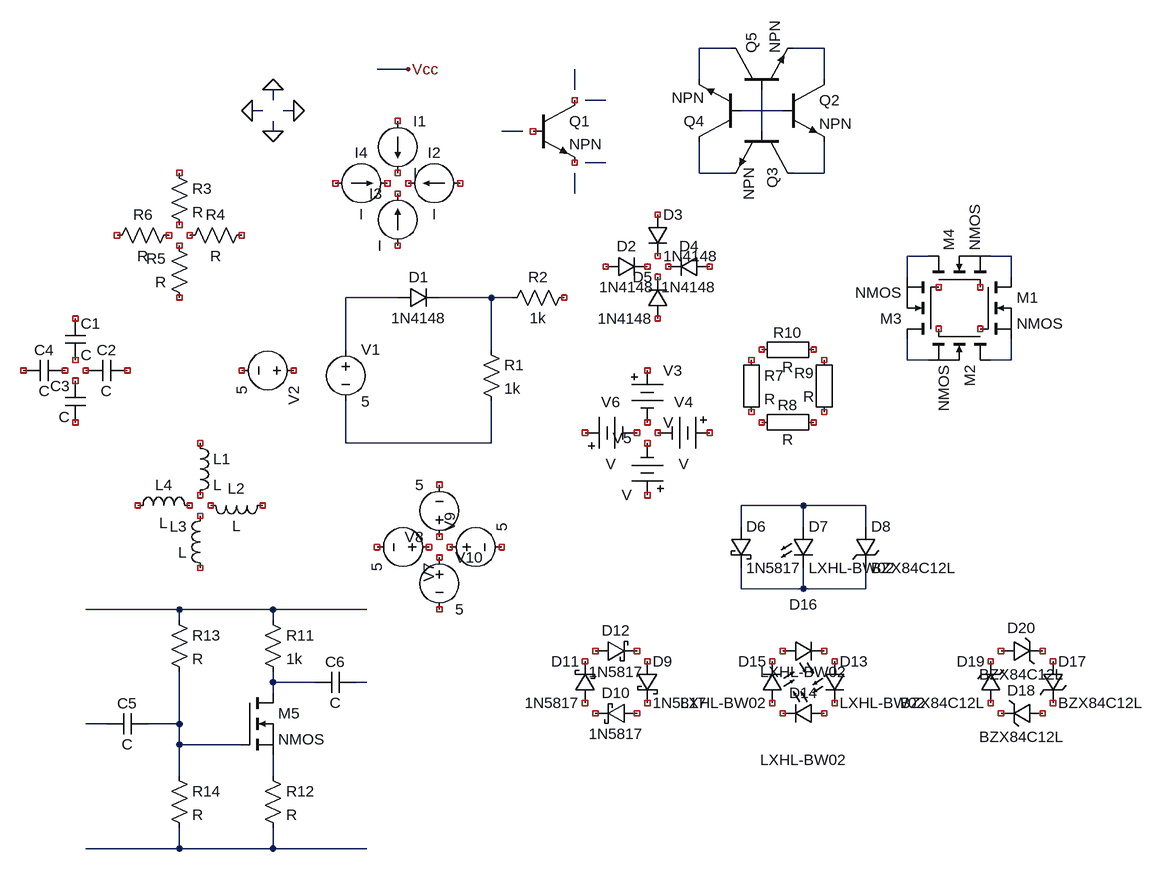
[diagram p0: schematic 20220804_circuit_01.asc]
20220804_circuit_01.asc, the LTspice schematic file:
Version 4
SHEET 1 1360 920
WIRE 720 -320 672 -320
WIRE 864 -320 816 -320
WIRE 224 -288 176 -288
WIRE 672 -272 672 -320
WIRE 864 -272 864 -320
WIRE 480 -256 480 -288
WIRE 16 -240 16 -256
WIRE 528 -240 496 -240
WIRE 0 -224 -16 -224
WIRE 48 -224 32 -224
WIRE 800 -224 736 -224
WIRE 16 -192 16 -208
WIRE 400 -192 368 -192
WIRE 768 -192 768 -256
WIRE 528 -144 496 -144
WIRE 672 -128 672 -176
WIRE 720 -128 672 -128
WIRE 864 -128 864 -176
WIRE 864 -128 816 -128
WIRE 480 -96 480 -128
WIRE 1024 0 992 0
WIRE 1152 0 1120 0
WIRE 992 32 992 0
WIRE 1152 32 1152 0
WIRE 208 64 128 64
WIRE 352 64 272 64
WIRE 384 64 352 64
WIRE 128 144 128 64
WIRE 352 144 352 64
WIRE 992 160 992 128
WIRE 1024 160 992 160
WIRE 1152 160 1152 128
WIRE 1152 160 1120 160
WIRE 128 288 128 224
WIRE 352 288 352 224
WIRE 352 288 128 288
WIRE 832 384 736 384
WIRE 928 384 832 384
WIRE 736 416 736 384
WIRE 832 416 832 384
WIRE 928 416 928 384
WIRE 736 512 736 480
WIRE 832 512 832 480
WIRE 832 512 736 512
WIRE 928 512 928 480
WIRE 928 512 832 512
WIRE -128 544 -272 544
WIRE 16 544 -128 544
WIRE 160 544 16 544
WIRE -128 560 -128 544
WIRE 16 560 16 544
WIRE 16 656 16 640
WIRE 80 656 16 656
WIRE 160 656 144 656
WIRE 16 672 16 656
WIRE -240 720 -272 720
WIRE -128 720 -128 640
WIRE -128 720 -176 720
WIRE -128 752 -128 720
WIRE -32 752 -128 752
WIRE -128 800 -128 752
WIRE 16 800 16 768
WIRE -128 912 -128 880
WIRE -128 912 -272 912
WIRE 16 912 16 880
WIRE 16 912 -128 912
WIRE 160 912 16 912
FLAG 16 -192 0
FLAG 48 -224 0
FLAG -16 -224 0
FLAG 16 -256 0
FLAG 224 -288 Vcc
SYMBOL voltage 128 128 R0
WINDOW 123 0 0 Left 0
WINDOW 39 0 0 Left 0
SYMATTR InstName V1
SYMATTR Value 5
SYMBOL res 336 128 R0
SYMATTR InstName R1
SYMATTR Value 1k
SYMBOL diode 208 80 R270
WINDOW 0 32 32 VTop 2
WINDOW 3 0 32 VBottom 2
SYMATTR InstName D1
SYMATTR Value 1N4148
SYMBOL voltage 64 176 R90
WINDOW 123 0 0 Left 0
WINDOW 39 0 0 Left 0
SYMATTR InstName V2
SYMATTR Value 5
SYMBOL res 480 48 R90
WINDOW 0 0 56 VBottom 2
WINDOW 3 32 56 VTop 2
SYMATTR InstName R2
SYMATTR Value 1k
SYMBOL res -144 -144 R0
SYMATTR InstName R3
SYMBOL res -16 -48 R90
WINDOW 0 0 56 VBottom 2
WINDOW 3 32 56 VTop 2
SYMATTR InstName R4
SYMBOL res -112 80 R180
WINDOW 0 36 76 Left 2
WINDOW 3 36 40 Left 2
SYMATTR InstName R5
SYMBOL res -240 -16 R270
WINDOW 0 32 56 VTop 2
WINDOW 3 0 56 VBottom 2
SYMATTR InstName R6
SYMBOL diode 528 32 R270
WINDOW 0 32 32 VTop 2
WINDOW 3 0 32 VBottom 2
SYMATTR InstName D2
SYMATTR Value 1N4148
SYMBOL diode 592 -64 R0
SYMATTR InstName D3
SYMATTR Value 1N4148
SYMBOL diode 688 0 R90
WINDOW 0 0 32 VBottom 2
WINDOW 3 32 32 VTop 2
SYMATTR InstName D4
SYMATTR Value 1N4148
SYMBOL diode 624 96 R180
WINDOW 0 24 64 Left 2
WINDOW 3 24 0 Left 2
SYMATTR InstName D5
SYMATTR Value 1N4148
SYMBOL Misc\\battery 592 160 R0
SYMATTR InstName V3
SYMBOL current 208 -208 R0
SYMATTR InstName I1
SYMBOL current 304 -112 R90
WINDOW 0 -32 40 VBottom 2
WINDOW 3 32 40 VTop 2
SYMATTR InstName I2
SYMBOL current 208 -16 R180
WINDOW 0 24 80 Left 2
WINDOW 3 24 0 Left 2
SYMATTR InstName I3
SYMBOL current 112 -112 R270
WINDOW 0 32 40 VTop 2
WINDOW 3 -32 40 VBottom 2
SYMATTR InstName I4
SYMBOL cap -304 96 R0
SYMATTR InstName C1
SYMBOL cap -208 160 R90
WINDOW 0 0 32 VBottom 2
WINDOW 3 32 32 VTop 2
SYMATTR InstName C2
SYMBOL cap -272 256 R180
WINDOW 0 24 56 Left 2
WINDOW 3 24 8 Left 2
SYMATTR InstName C3
SYMBOL cap -368 192 R270
WINDOW 0 32 32 VTop 2
WINDOW 3 0 32 VBottom 2
SYMATTR InstName C4
SYMBOL ind -112 272 R0
SYMATTR InstName L1
SYMBOL ind 16 368 R90
WINDOW 0 5 56 VBottom 2
WINDOW 3 32 56 VTop 2
SYMATTR InstName L2
SYMBOL ind -80 496 R180
WINDOW 0 36 80 Left 2
WINDOW 3 36 40 Left 2
SYMATTR InstName L3
SYMBOL ind -208 400 R270
WINDOW 0 32 56 VTop 2
WINDOW 3 5 56 VBottom 2
SYMATTR InstName L4
SYMBOL Misc\\battery 704 272 R90
WINDOW 0 -32 56 VBottom 2
WINDOW 3 32 56 VTop 2
SYMATTR InstName V4
SYMBOL Misc\\battery 592 384 R180
WINDOW 0 24 104 Left 2
WINDOW 3 24 16 Left 2
SYMATTR InstName V5
SYMBOL Misc\\battery 480 272 R270
WINDOW 0 32 56 VTop 2
WINDOW 3 -32 56 VBottom 2
SYMATTR InstName V6
SYMBOL voltage 272 448 R90
WINDOW 123 0 0 Left 0
WINDOW 39 0 0 Left 0
SYMATTR InstName V7
SYMATTR Value 5
SYMBOL voltage 272 448 R180
WINDOW 123 0 0 Left 0
WINDOW 39 0 0 Left 0
SYMATTR InstName V8
SYMATTR Value 5
SYMBOL voltage 272 448 R270
WINDOW 123 0 0 Left 0
WINDOW 39 0 0 Left 0
SYMATTR InstName V9
SYMATTR Value 5
SYMBOL voltage 272 448 R0
WINDOW 123 0 0 Left 0
WINDOW 39 0 0 Left 0
SYMATTR InstName V10
SYMATTR Value 5
SYMBOL npn 416 -240 R0
SYMATTR InstName Q1
SYMBOL npn 800 -272 R0
SYMATTR InstName Q2
SYMBOL npn 816 -192 R90
SYMATTR InstName Q3
SYMBOL npn 736 -176 R180
SYMATTR InstName Q4
SYMBOL npn 720 -256 R270
SYMATTR InstName Q5
SYMBOL Misc\\EuropeanResistor 736 144 R0
SYMATTR InstName R7
SYMBOL nmos 1104 32 R0
SYMATTR InstName M1
SYMBOL nmos 1120 112 R90
SYMATTR InstName M2
SYMBOL nmos 1040 128 R180
SYMATTR InstName M3
SYMBOL nmos 1024 48 R270
SYMATTR InstName M4
SYMBOL schottky 720 416 R0
SYMATTR InstName D6
SYMATTR Value 1N5817
SYMATTR Description Diode
SYMATTR Type diode
SYMBOL LED 816 416 R0
SYMATTR InstName D7
SYMATTR Value LXHL-BW02
SYMATTR Description Diode
SYMATTR Type diode
SYMBOL zener 912 416 R0
SYMATTR InstName D8
SYMATTR Value BZX84C12L
SYMATTR Description Diode
SYMATTR Type diode
SYMBOL schottky 576 624 R0
SYMATTR InstName D9
SYMATTR Value 1N5817
SYMATTR Description Diode
SYMATTR Type diode
SYMBOL schottky 576 688 R90
WINDOW 0 0 32 VBottom 2
WINDOW 3 32 32 VTop 2
SYMATTR InstName D10
SYMATTR Value 1N5817
SYMATTR Description Diode
SYMATTR Type diode
SYMBOL schottky 512 688 R180
WINDOW 0 24 64 Left 2
WINDOW 3 24 0 Left 2
SYMATTR InstName D11
SYMATTR Value 1N5817
SYMATTR Description Diode
SYMATTR Type diode
SYMBOL schottky 512 624 R270
WINDOW 0 32 32 VTop 2
WINDOW 3 0 32 VBottom 2
SYMATTR InstName D12
SYMATTR Value 1N5817
SYMATTR Description Diode
SYMATTR Type diode
SYMBOL LED 864 624 R0
SYMATTR InstName D13
SYMATTR Value LXHL-BW02
SYMATTR Description Diode
SYMATTR Type diode
SYMBOL LED 864 688 R90
WINDOW 0 0 32 VBottom 2
WINDOW 3 72 32 VTop 2
SYMATTR InstName D14
SYMATTR Value LXHL-BW02
SYMATTR Description Diode
SYMATTR Type diode
SYMBOL LED 800 688 R180
WINDOW 0 24 64 Left 2
WINDOW 3 24 0 Left 2
SYMATTR InstName D15
SYMATTR Value LXHL-BW02
SYMATTR Description Diode
SYMATTR Type diode
SYMBOL LED 800 624 R270
WINDOW 0 72 32 VTop 2
WINDOW 3 0 32 VBottom 2
SYMATTR InstName D16
SYMATTR Value LXHL-BW02
SYMATTR Description Diode
SYMATTR Type diode
SYMBOL zener 1200 624 R0
SYMATTR InstName D17
SYMATTR Value BZX84C12L
SYMATTR Description Diode
SYMATTR Type diode
SYMBOL zener 1200 688 R90
WINDOW 0 -4 32 VBottom 2
WINDOW 3 36 32 VTop 2
SYMATTR InstName D18
SYMATTR Value BZX84C12L
SYMATTR Description Diode
SYMATTR Type diode
SYMBOL zener 1136 688 R180
WINDOW 0 24 64 Left 2
WINDOW 3 24 0 Left 2
SYMATTR InstName D19
SYMATTR Value BZX84C12L
SYMATTR Description Diode
SYMATTR Type diode
SYMBOL zener 1136 624 R270
WINDOW 0 36 32 VTop 2
WINDOW 3 -4 32 VBottom 2
SYMATTR InstName D20
SYMATTR Value BZX84C12L
SYMATTR Description Diode
SYMATTR Type diode
SYMBOL Misc\\EuropeanResistor 864 240 R90
WINDOW 0 5 56 VBottom 2
WINDOW 3 27 56 VTop 2
SYMATTR InstName R8
SYMBOL Misc\\EuropeanResistor 880 256 R180
WINDOW 0 31 76 Left 2
WINDOW 3 31 40 Left 2
SYMATTR InstName R9
SYMBOL Misc\\EuropeanResistor 752 160 R270
WINDOW 0 27 56 VTop 2
WINDOW 3 5 56 VBottom 2
SYMATTR InstName R10
SYMBOL nmos -32 672 R0
SYMATTR InstName M5
SYMBOL res 0 544 R0
SYMATTR InstName R11
SYMATTR Value 1k
SYMBOL res 0 784 R0
SYMATTR InstName R12
SYMBOL res -144 544 R0
SYMATTR InstName R13
SYMBOL res -144 784 R0
SYMATTR InstName R14
SYMBOL cap -176 704 R90
WINDOW 0 0 32 VBottom 2
WINDOW 3 32 32 VTop 2
SYMATTR InstName C5
SYMBOL cap 144 640 R90
WINDOW 0 0 32 VBottom 2
WINDOW 3 32 32 VTop 2
SYMATTR InstName C6

The netlist it stands for:
* 20220804_circuit_01.asc
V1 N014 N018 5
R1 N015 N018 1k
D1 N014 N015 1N4148
V2 NC_01 NC_02 5
R2 NC_03 N015 1k
R3 NC_04 NC_05 R
R4 NC_06 NC_07 R
R5 NC_08 NC_09 R
R6 NC_10 NC_11 R
D2 NC_12 NC_13 1N4148
D3 NC_14 NC_15 1N4148
D4 NC_16 NC_17 1N4148
D5 NC_18 NC_19 1N4148
V3 NC_20 NC_21 V
I1 NC_22 NC_23 I
I2 NC_24 NC_25 I
I3 NC_26 NC_27 I
I4 NC_28 NC_29 I
C1 NC_30 NC_31 C
C2 NC_32 NC_33 C
C3 NC_34 NC_35 C
C4 NC_36 NC_37 C
L1 NC_38 NC_39 L
L2 NC_40 NC_41 L
L3 NC_42 NC_43 L
L4 NC_44 NC_45 L
V4 NC_46 NC_47 V
V5 NC_48 NC_49 V
V6 NC_50 NC_51 V
V7 NC_52 NC_53 5
V8 NC_54 NC_55 5
V9 NC_56 NC_57 5
V10 NC_58 NC_59 5
Q1 NC_60 NC_61 NC_62 0 NPN
Q2 N002 N005 N010 0 NPN
Q3 N010 N007 N009 0 NPN
Q4 N009 N005 N001 0 NPN
Q5 N001 N007 N002 0 NPN
R7 NC_63 NC_64 R
M1 N013 NC_65 N017 N017 NMOS
M2 N017 NC_66 N016 N016 NMOS
M3 N016 NC_67 N012 N012 NMOS
M4 N012 NC_68 N013 N013 NMOS
D6 N019 N020 1N5817
D7 N019 N020 LXHL-BW02
D8 N019 N020 BZX84C12L
D9 NC_69 NC_70 1N5817
D10 NC_71 NC_72 1N5817
D11 NC_73 NC_74 1N5817
D12 NC_75 NC_76 1N5817
D13 NC_77 NC_78 LXHL-BW02
D14 NC_79 NC_80 LXHL-BW02
D15 NC_81 NC_82 LXHL-BW02
D16 NC_83 NC_84 LXHL-BW02
D17 NC_85 NC_86 BZX84C12L
D18 NC_87 NC_88 BZX84C12L
D19 NC_89 NC_90 BZX84C12L
D20 NC_91 NC_92 BZX84C12L
R8 NC_93 NC_94 R
R9 NC_95 NC_96 R
R10 NC_97 NC_98 R
M5 N022 N025 N026 N026 NMOS
R11 N021 N022 1k
R12 N026 N027 R
R13 N021 N025 R
R14 N025 N027 R
C5 N025 N024 C
C6 N023 N022 C
.model D D
.lib standard.dio
.model NPN NPN
.model PNP PNP
.lib standard.bjt
.model NMOS NMOS
.model PMOS PMOS
.lib standard.mos
.backanno
.end